# EAGLE design sidedriver_v1 (EAGLE 6.4)
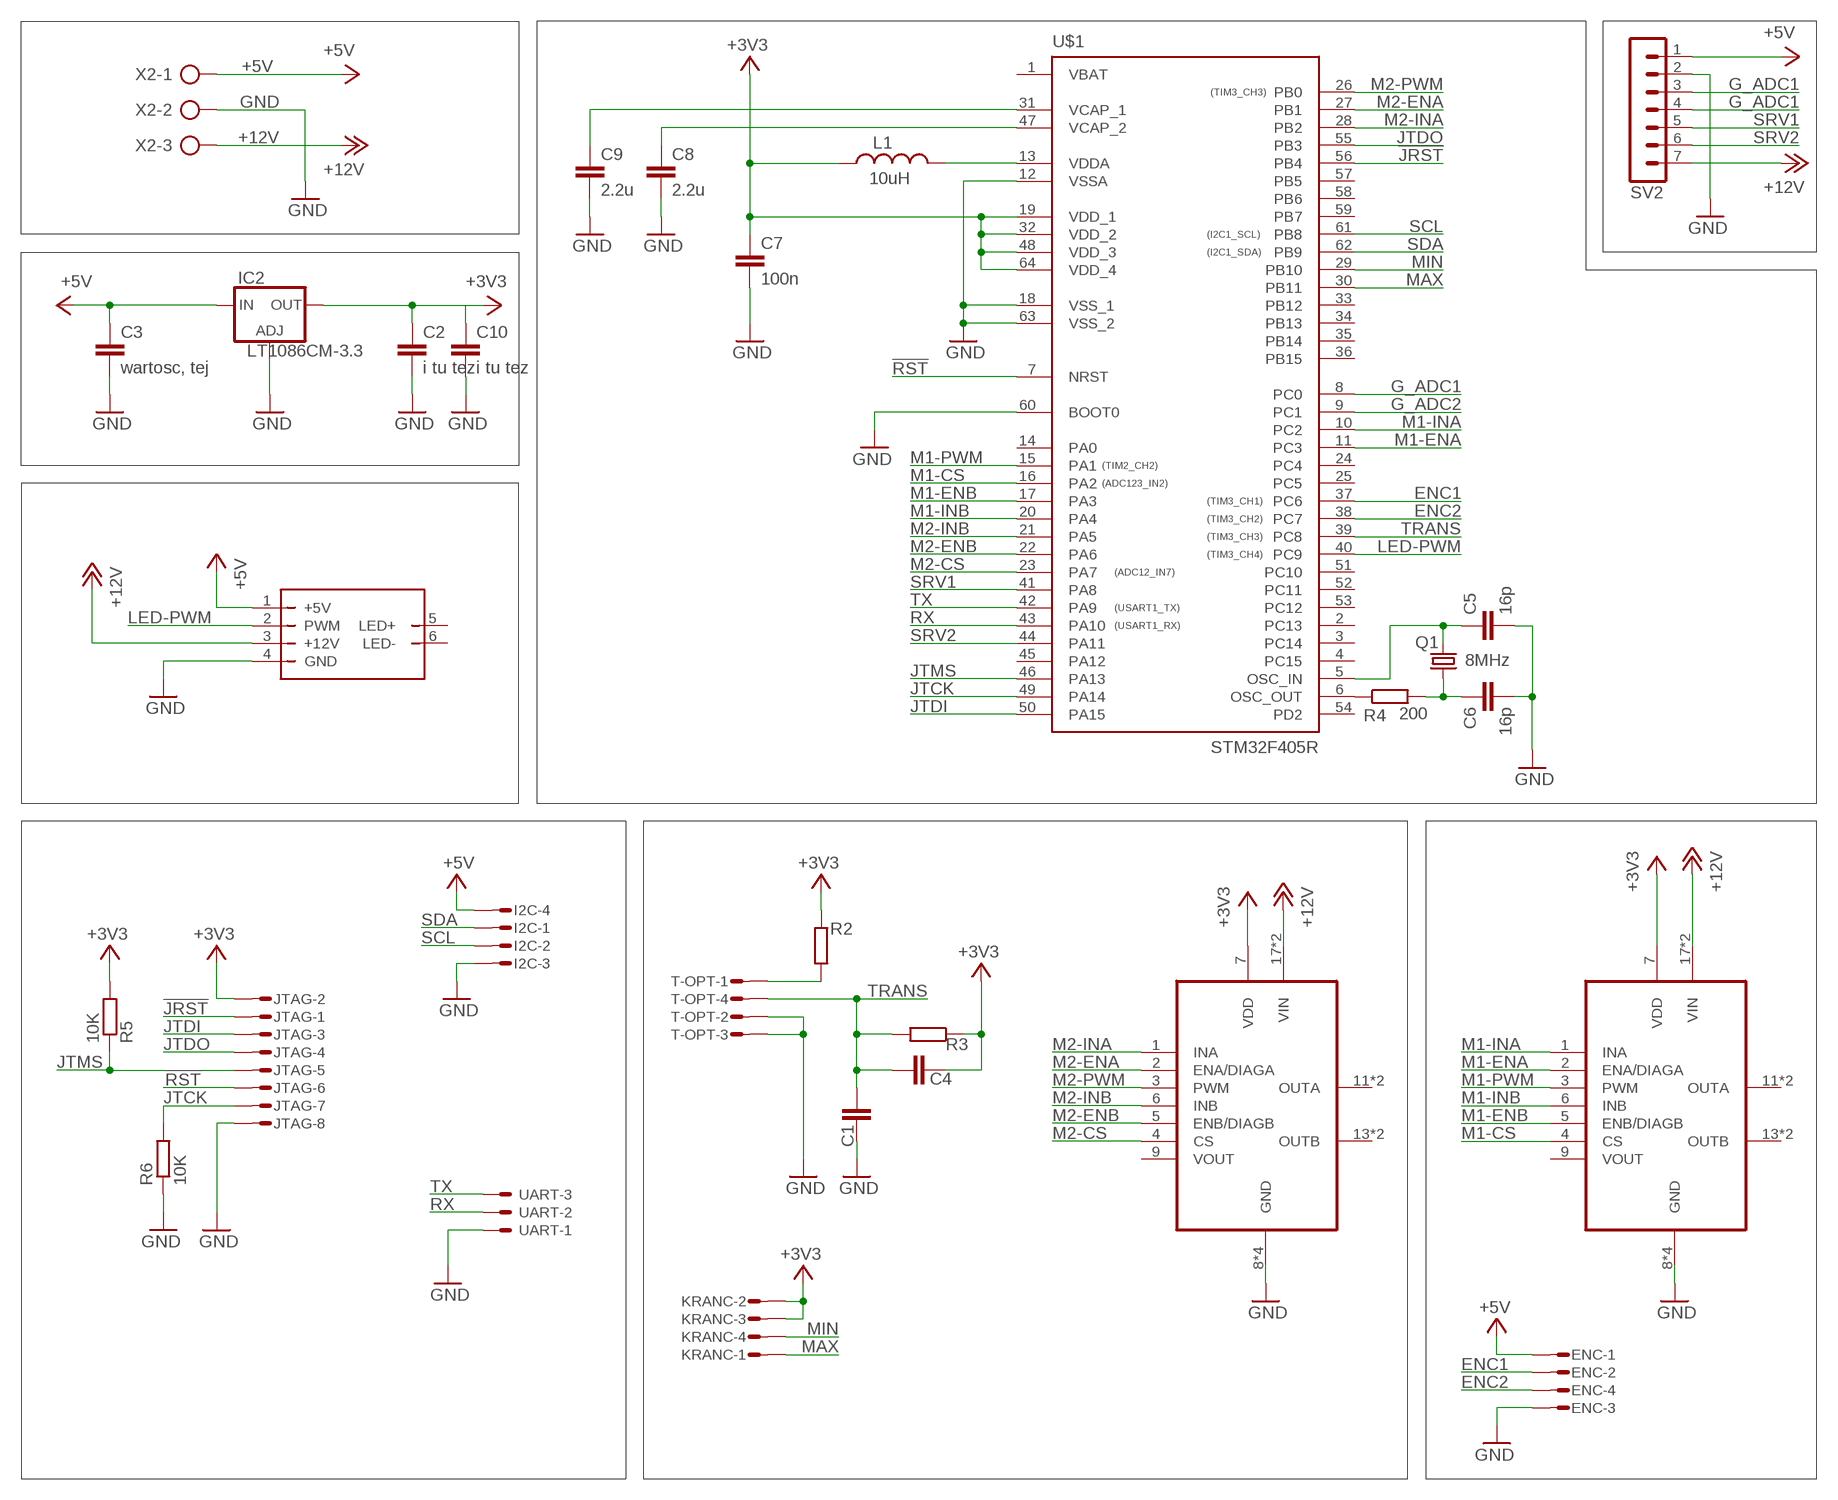
[diagram p0: schematic, sheet 1]

## Parts
C1  C-EUC0603  [C0603]
C2  i tu tez  C-EUC0603  [C0603]
C3  wartosc, tej  C-EUC0603  [C0603]
C4  C-EUC0603  [C0603]
C5  16p  C-EUC0603  [C0603]
C6  16p  C-EUC0603  [C0603]
C7  100n  C-EUC0603  [C0603]
C8  2.2u  C-EUC0603  [C0603]
C9  2.2u  C-EUC0603  [C0603]
C10  i tu tez  C-EUC0603  [C0603]
ENC  MICROMATCH-4  [MICROMATCH-4]
I2C  MICROMATCH-4  [MICROMATCH-4]
IC2  LT1086CM-3.3  LD117AD2MTR  [D2PACK]
JTAG  MICROMATCH-8  [MICROMATCH-8]
KRANC  MICROMATCH-4  [MICROMATCH-4]
L1  10uH  L  [L0805]
Q1  8MHz  CRYSTAL12SMX  [12SMX]
R2  R-EU_R0603  [R0603]
R3  R-EU_R0603  [R0603]
R4  200  R-EU_R0603  [R0603]
R5  10K  R-EU_R0603  [R0603]
R6  10K  R-EU_R0603  [R0603]
SV2  MA07-1  [MA07-1]
T-OPT  MICROMATCH-4  [MICROMATCH-4]
U$1  STM32F405R  [TQFP64]
U$2  LEDD1  [LEDD1]
U$3  POLOLU-1451  [POLOLU-1451]
U$4  POLOLU-1451  [POLOLU-1451]
UART  C-GRID-03-70543  [70543-03]
X2  AK500/3  [AK500/3]

## Nets
!JRST: JTAG.1 U$1.56(PB4)
!RST: JTAG.6 U$1.7(NRST)
+3V3: C2.1 C4.1 C7.1 C10.1 IC2.2(OUT) JTAG.2 KRANC.2 KRANC.3 L1.1 R2.1 R3.1 R5.2 U$1.19(VDD_1) U$1.32(VDD_2) U$1.48(VDD_3) U$1.64(VDD_4) U$3.7(VDD) U$4.7(VDD)
+5V: C3.1 ENC.1 I2C.4 IC2.3(IN) SV2.1 U$2.1(+5V) X2.1
+12V: SV2.7 U$2.3(+12V) U$3.17(VIN) U$3.18(VIN) U$4.17(VIN) U$4.18(VIN) X2.3
ENC1: ENC.2 U$1.37(PC6)
ENC2: ENC.4 U$1.38(PC7)
G_ADC1: SV2.3 U$1.8(PC0)
G_ADC2: SV2.4 U$1.9(PC1)
GND: C1.1 C2.2 C3.2 C5.2 C6.2 C7.2 C8.2 C9.2 C10.2 ENC.3 I2C.3 IC2.1(ADJ) JTAG.8 R6.1 SV2.2 T-OPT.2 T-OPT.3 U$1.12(VSSA) U$1.18(VSS_1) U$1.60(BOOT0) U$1.63(VSS_2) U$2.4(GND) U$3.8(GND) U$3.10(GND) U$3.15(GND) U$3.16(GND) U$4.8(GND) U$4.10(GND) U$4.15(GND) U$4.16(GND) UART.1 X2.2
JTCK: JTAG.7 R6.2 U$1.49(PA14)
JTDI: JTAG.3 U$1.50(PA15)
JTDO: JTAG.4 U$1.55(PB3)
JTMS: JTAG.5 R5.1 U$1.46(PA13)
LED-PWM: U$1.40(PC9) U$2.2(PWM)
M1-CS: U$1.16(PA2) U$4.4(CS)
M1-ENA: U$1.11(PC3) U$4.2(ENA/DIAGA)
M1-ENB: U$1.17(PA3) U$4.5(ENB/DIAGB)
M1-INA: U$1.10(PC2) U$4.1(INA)
M1-INB: U$1.20(PA4) U$4.6(INB)
M1-PWM: U$1.15(PA1) U$4.3(PWM)
M2-CS: U$1.23(PA7) U$3.4(CS)
M2-ENA: U$1.27(PB1) U$3.2(ENA/DIAGA)
M2-ENB: U$1.22(PA6) U$3.5(ENB/DIAGB)
M2-INA: U$1.28(PB2) U$3.1(INA)
M2-INB: U$1.21(PA5) U$3.6(INB)
M2-PWM: U$1.26(PB0) U$3.3(PWM)
MAX: KRANC.1 U$1.30(PB11)
MIN: KRANC.4 U$1.29(PB10)
N$1: R2.2 T-OPT.1
N$4: C6.1 Q1.1 R4.2
N$5: C5.1 Q1.3 U$1.5(OSC_IN)
N$20: L1.2 U$1.13(VDDA)
N$22: R4.1 U$1.6(OSC_OUT)
N$23: C8.1 U$1.47(VCAP_2)
N$24: C9.1 U$1.31(VCAP_1)
RX: U$1.43(PA10) UART.2
SCL: I2C.2 U$1.61(PB8)
SDA: I2C.1 U$1.62(PB9)
SRV1: SV2.5 U$1.41(PA8)
SRV2: SV2.6 U$1.44(PA11)
TRANS: C1.2 C4.2 R3.2 T-OPT.4 U$1.39(PC8)
TX: U$1.42(PA9) UART.3
Unconnected: U$1.1(VBAT) U$1.2(PC13) U$1.3(PC14) U$1.4(PC15) U$1.14(PA0) U$1.24(PC4) U$1.25(PC5) U$1.33(PB12) U$1.34(PB13) U$1.35(PB14) U$1.36(PB15) U$1.45(PA12) U$1.51(PC10) U$1.52(PC11) U$1.53(PC12) U$1.54(PD2) U$1.57(PB5) U$1.58(PB6) U$1.59(PB7) U$2.5(LED+) U$2.6(LED-) U$3.9(VOUT) U$3.11(OUTA) U$3.12(OUTA) U$3.13(OUTB) U$3.14(OUTB) U$4.9(VOUT) U$4.11(OUTA) U$4.12(OUTA) U$4.13(OUTB) U$4.14(OUTB)

## Notes on the sheet
- (TIM3_CH3)
- (I2C1_SCL)
- (I2C1_SDA)
- (TIM2_CH2)
- (ADC123_IN2)
- (TIM3_CH1)
- (TIM3_CH2)
- (TIM3_CH3)
- (TIM3_CH4)
- (ADC12_IN7)
- (USART1_TX)
- (USART1_RX)

## Library data of the parts
C1-C10 = rcl:C-EU: CAPACITOR, European symbol
ENC I2C KRANC T-OPT = con-maritex:MICROMATCH-4: MicroMaTch 4 7-215464-4 / 0-215464-4 Drawing Number C-215464 DDEController.pdf
IC2 = v-reg:LD117A?*: Low drop fixed and adjustable positive voltage regulators 1 A Source: http://www.st.com/stonline/products/literature/ds/7194/ld1117axx.pdf
JTAG = con-maritex:MICROMATCH-8: MicroMaTch 8 7-215464-8 / 0-215464-8 Drawing Number C-215464 DDEController.pdf
L1 = con-maritex:L
Q1 = wb:CRYSTAL: CRYSTAL
R2-R6 = rcl:R-EU_: RESISTOR, European symbol
SV2 = con-lstb:MA07-1: PIN HEADER; OC_FARNELL: unknown; OC_NEWARK: unknown
U$1 = stm32f4:STM32F405R: STM32F405 64 pin LQFP reviewed: YES tested: YES
U$2 = ledd1:LEDD1
U$3 U$4 = pololu:POLOLU-1451
UART = con-molex:C-GRID-03: CONNECTOR wire to board 2.54 mm (0.100") pitch header; OC_FARNELL: unknown; OC_NEWARK: unknown
X2 = con-ptr500:AK500/3: CONNECTOR; OC_FARNELL: unknown; OC_NEWARK: unknown

## Board
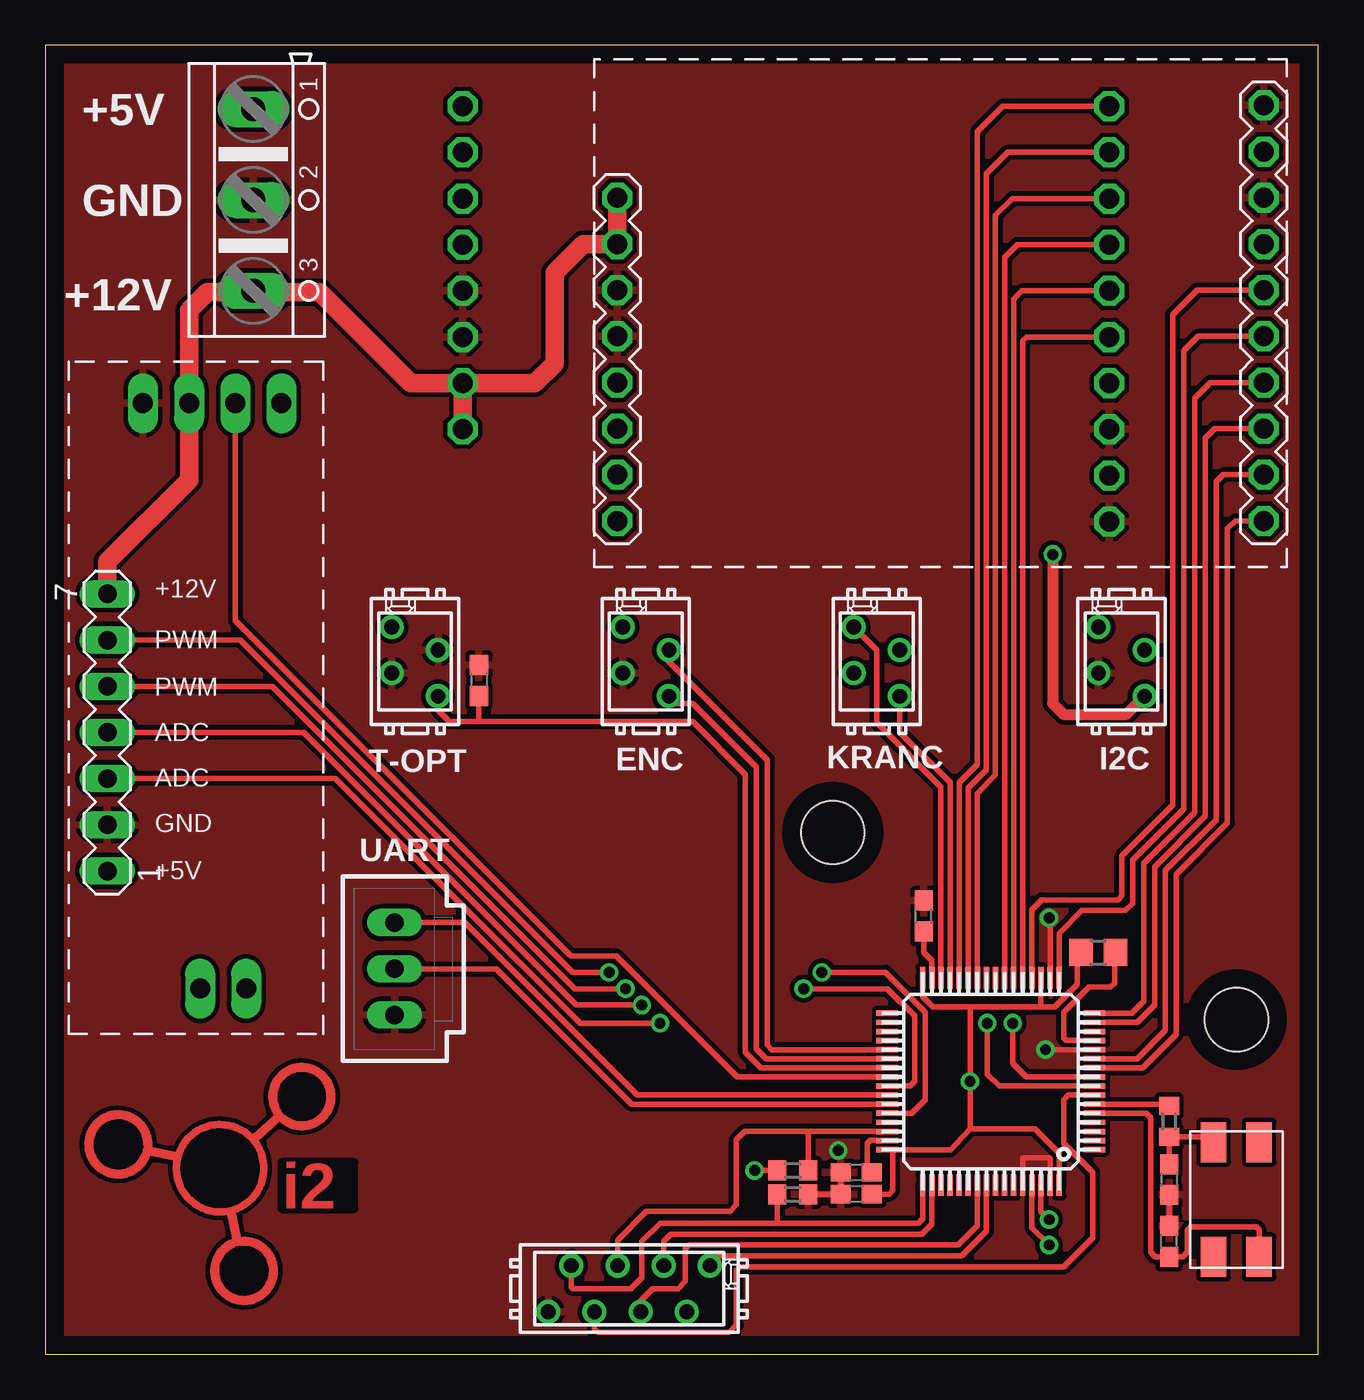
[diagram p1: board, top side]
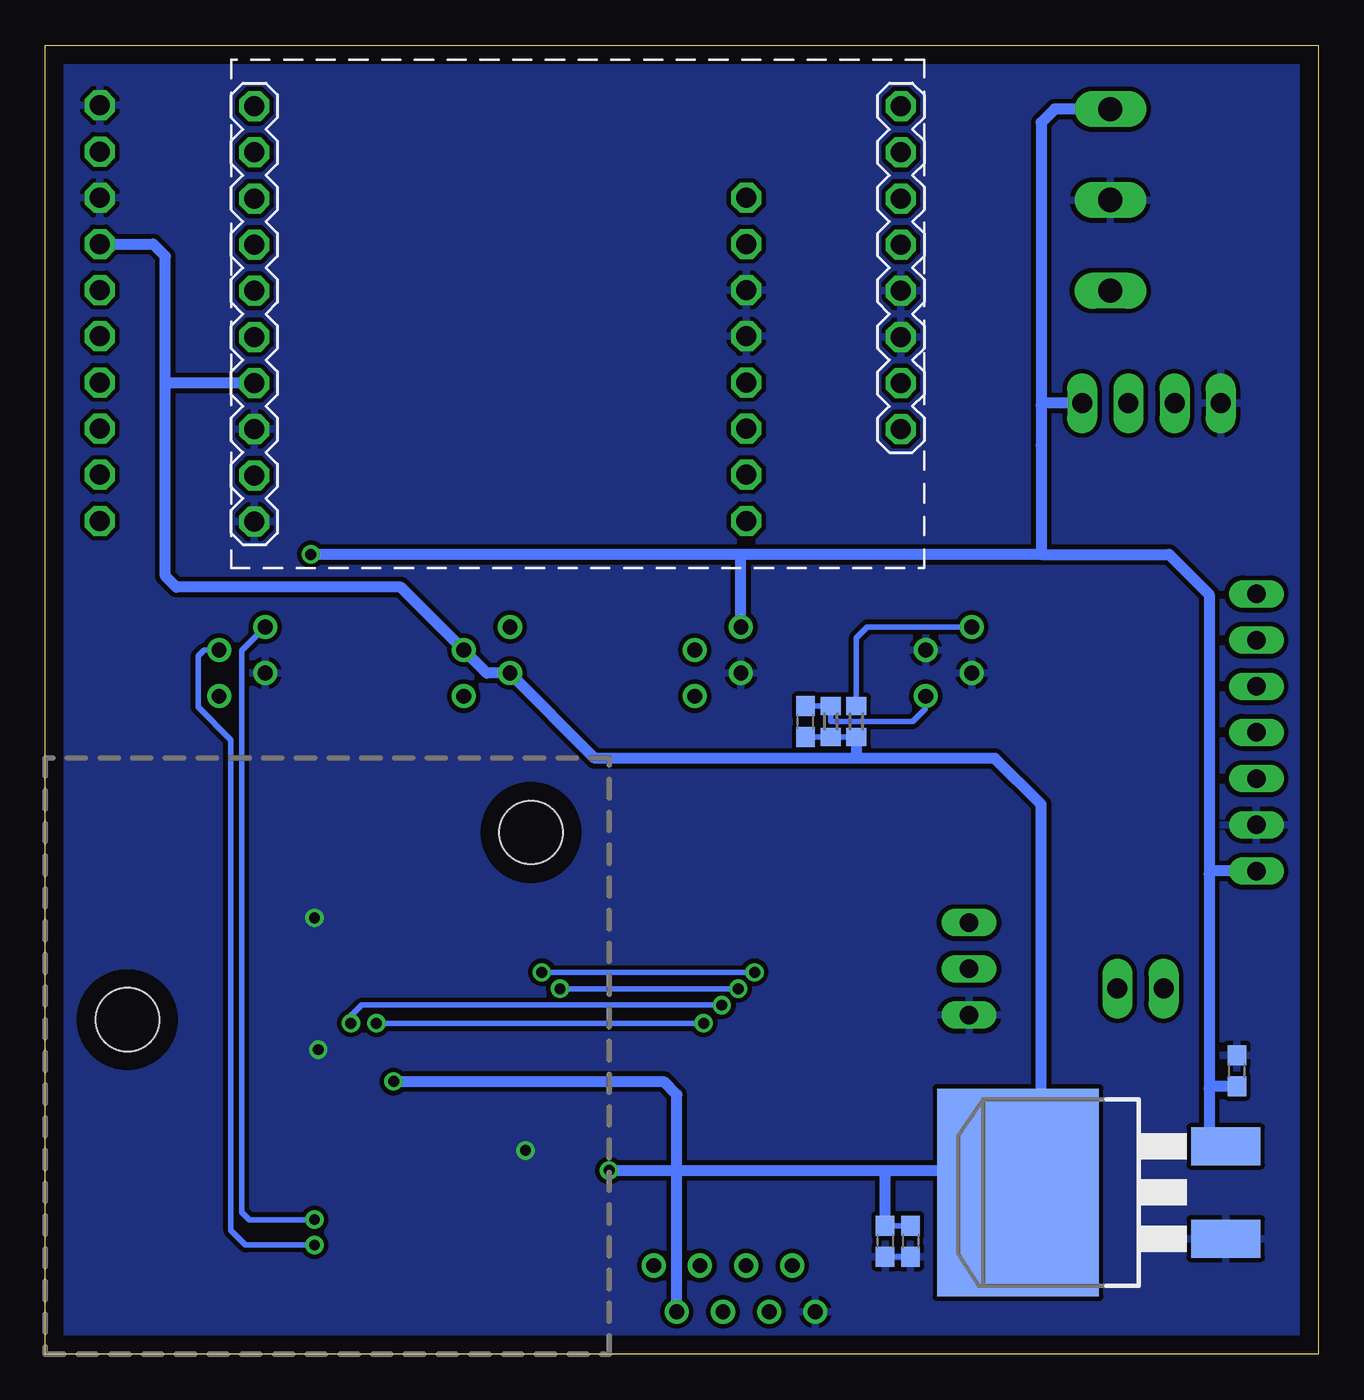
[diagram p2: board, bottom side, seen from below]

Size 70 x 72 mm. Coordinates in mm from the lower left corner, seen from the top.
Outline: 0,0 70,0 70,72 0,72 0,0
Copper layers (1*16): Top 0.035mm / dielectric 1.5mm / Bottom 0.035mm
Design rules "default *": minimum track width 10mil, minimum drill 0.5mm, track to track 6mil, track to pad 6mil, pad to pad 6mil, via to via 6mil, smd to smd 6mil, copper to edge 40mil, drill to drill 8mil, minimum pad ring 10mil, minimum via ring 8mil, stop-mask expansion 4mil, vias tented up to drill 0mil, thermal gap 10mil
Holes 3.5 mm at 65.5,18.4 43.3,28.7

### Footprints (pad centres in the part's own frame; a part is rotated, then mirrored left to right if it is on the bottom)
C0603 = smd 1.1 x 1: 1 -0.85,0; 2 0.85,0
MICROMATCH-4 = drill 0.813: 1 1.905,1.27; 2 0.635,-1.27; 3 -0.635,1.27; 4 -1.905,-1.27
D2PACK = smd 2.083 x 3.81: 1 -2.54,-8.89; 3 2.54,-8.89 | smd 11.43 x 8.89: 2 0,2.54
MICROMATCH-8 = drill 0.813: 1 4.445,1.27; 2 3.175,-1.27; 3 1.905,1.27; 4 0.635,-1.27; 5 -0.635,1.27; 6 -1.905,-1.27; 7 -3.175,1.27; 8 -4.445,-1.27
L0805 = smd 1.3 x 1.5: 1 -0.95,0; 2 0.95,0
12SMX = smd 2.2 x 1.4: 1 -3.15,-1.25; 2 -3.15,1.25; 3 3.15,1.25; 4 3.15,-1.25
R0603 = smd 1 x 1.1: 1 -0.85,0; 2 0.85,0
MA07-1 = drill 1.016 long: 1 -7.62,0; 2 -5.08,0; 3 -2.54,0; 4 0,0; 5 2.54,0; 6 5.08,0; 7 7.62,0
TQFP64 = smd 1.2 x 0.3: 1 -5.7,3.75; 2 -5.7,3.25; 3 -5.7,2.75; 4 -5.7,2.25; 5 -5.7,1.75; 6 -5.7,1.25; 7 -5.7,0.75; 8 -5.7,0.25; 9 -5.7,-0.25; 10 -5.7,-0.75; 11 -5.7,-1.25; 12 -5.7,-1.75; 13 -5.7,-2.25; 14 -5.7,-2.75; 15 -5.7,-3.25; 16 -5.7,-3.75; 33 5.7,-3.75; 34 5.7,-3.25; 35 5.7,-2.75; 36 5.7,-2.25; 37 5.7,-1.75; 38 5.7,-1.25; 39 5.7,-0.75; 40 5.7,-0.25; 41 5.7,0.25; 42 5.7,0.75; 43 5.7,1.25; 44 5.7,1.75; 45 5.7,2.25; 46 5.7,2.75; 47 5.7,3.25; 48 5.7,3.75 | smd 0.3 x 1.2: 17 -3.75,-5.7; 18 -3.25,-5.7; 19 -2.75,-5.7; 20 -2.25,-5.7; 21 -1.75,-5.7; 22 -1.25,-5.7; 23 -0.75,-5.7; 24 -0.25,-5.7; 25 0.25,-5.7; 26 0.75,-5.7; 27 1.25,-5.7; 28 1.75,-5.7; 29 2.25,-5.7; 30 2.75,-5.7; 31 3.25,-5.7; 32 3.75,-5.7; 49 3.75,5.7; 50 3.25,5.7; 51 2.75,5.7; 52 2.25,5.7; 53 1.75,5.7; 54 1.25,5.7; 55 0.75,5.7; 56 0.25,5.7; 57 -0.25,5.7; 58 -0.75,5.7; 59 -1.25,5.7; 60 -1.75,5.7; 61 -2.25,5.7; 62 -2.75,5.7; 63 -3.25,5.7; 64 -3.75,5.7
LEDD1 = drill 1.1 long: 1 2.3,11.71; 2 2.3,9.17; 3 2.3,6.63; 4 2.3,4.09; 5 34.5,9.77; 6 34.5,7.23
POLOLU-1451 = drill 1.1 octagon: 1 -16.51,10.16; 2 -16.51,7.62; 3 -16.51,5.08; 4 -16.51,2.54; 5 -16.51,0; 6 -16.51,-2.54; 7 -16.51,-5.08; 8 -16.51,-7.62; 9 -16.51,-10.16; 10 -16.51,-12.7; 11 19.05,10.16; 12 19.05,7.62; 13 19.05,5.08; 14 19.05,2.54; 15 19.05,0; 16 19.05,-2.54; 17 19.05,-5.08; 18 19.05,-7.62
70543-03 = drill 1.016 long: 1 -2.54,0; 2 0,0; 3 2.54,0
AK500/3 = drill 1.321 long: 1 -5.004,0; 2 0,0; 3 5.004,0

### Placement (x,y rotation side)
C1  23.84,37.07 270 top
C2  22.43,6.21 270 bottom
C3  4.47,15.59 90 bottom
C4  28.2,34.8 90 bottom
C5  61.8,6.2 90 top
C6  61.8,9.6 270 top
C7  44.6,8.8 180 top
C8  44.6,10 180 top
C9  48.3,24.1 90 top
C10  23.82,6.21 270 bottom
ENC  33.02,38.1 90 top
I2C  59.18,38.1 90 top
IC2  13.97,8.89 90 bottom
JTAG  32.1,3.6 0 top
KRANC  45.72,38.1 90 top
L1  57.9,22.1 0 top
Q1  65.5,8.5 270 top
R2  25.4,34.8 90 bottom
R3  26.8,34.8 90 bottom
R4  61.8,12.8 270 top
R5  41.1,10.1 180 top
R6  41.1,8.8 180 top
SV2  3.4,34.2 90 top
T-OPT  20.32,38.1 90 top
U$1  52,15 180 top
U$2  1.27,54.61 270 top
U$3  42,58.5 0 bottom
U$4  50.5,56 180 top
U$5  [I2-LOGO]  9.8,10.6 0 top
UART  19.2,21.2 90 top
X2  11.43,63.5 270 top

### Tracks (layer width: path | path; a pad name or v marks a point on that pad's centre or on a via)
!JRST
  Top 0.305: U$1.56 51.75,6.75 50.4,5.4 37,5.4 36.55,4.95 JTAG.1
!RST
  Top 0.305: JTAG.6 30.2,1.41 30.4,1.2 37.6,1.2 38,1.6 38,4.6 38.2,4.8 56,4.8 57.6,6.4 57.6,10 56,11.6 56,14 56.25,14.25 U$1.7
+3V3  (via drill 0.6)
  Top 0.305: U$1.48 46.6,11.25 | C7.1 46.4,8.8 46.6,9 46.6,11.25 | v39,10.1 R5.2 | 50.85,12.4 v50.85,15 50.85,19.05 50.8,19.1 | 50.85,12.4 50.05,11.5 49.8,11.25 46.6,11.25 | U$1.19 54.75,19.15 54.8,19.1 | U$1.64 55.75,11.05 54.4,12.4 50.85,12.4 | L1.1 56.75,21.5 56.75,20.35 55.5,19.1 54.8,19.1 | U$1.32 48.25,19.65 48.8,19.1 50.8,19.1 | 50.8,19.1 54.8,19.1
  Bottom 0.305: C10.1 C2.1 | R2.1 R3.1 C4.1 | 23.82,10.08 23.8,10.1 | 17.72,10.1 IC2.2
  Bottom 0.61: IC2.2 15.24,10.16 15.24,30.24 17.78,32.78 25.4,32.78 | 44.47,37.47 45.72,37.47 KRANC.2 50.45,42.2 62.8,42.2 63.4,42.8 63.4,53.4 | C10.1 23.82,10.08 | JTAG.2 35.27,10.1 | U$3.7 63.18,53.42 63.4,53.4 | U$4.7 64.08,61.08 63.4,60.4 63.4,53.4 | 25.4,32.78 39.78,32.78 44.47,37.47 | R2.1 25.4,32.78 | 35.27,10.1 35.27,14.28 36,15 v50.85,15 | v39,10.1 35.27,10.1 | KRANC.3 44.47,37.47 | 35.27,10.1 23.8,10.1 17.72,10.1
+5V  (via drill 0.6)
  Top 0.61: v55.4,44 55.4,35.8 56,35.2 59.46,35.2 I2C.4
  Bottom 0.305: 31.75,43.95 31.8,44
  Bottom 0.61: X2.1 14.5,68.5 15.24,67.76 15.24,52.2 | 15.24,52.2 15.24,49.99 15.23,44 | 15.23,44 31.8,44 v55.4,44 | ENC.1 31.75,43.95 | U$2.1 15.13,52.31 15.24,52.2 | 15.23,44 8.2,44 6,41.8 6,26.4 | 6,26.4 6,14.6 | 6,14.6 6,11.8 5.8,11.6 5.25,11.6 IC2.3 | SV2.1 5.82,26.58 6,26.4 | C3.1 5.86,14.74 6,14.6
+12V
  Top 0.813: 11.35,58.42 X2.3 11.51,58.42
  Top 1.016: U$4.18 U$4.17 29.58,61.08 28,59.5 28,54.5 26.92,53.42 U$3.17 | 11.35,58.42 8.89,58.42 7.9,57.43 U$2.3 7.9,48.1 3.4,43.6 SV2.7 | U$3.18 U$3.17 | 11.51,58.42 15.08,58.42 20.08,53.42 U$3.17
ENC1
  Top 0.305: U$1.37 39.95,16.75 39.7,17 39.7,32.7 34.29,38.11 ENC.2
ENC2
  Top 0.305: U$1.38 39.65,16.25 39.1,16.8 39.1,32.3 35.6,35.8 34.69,35.8 ENC.4
G_ADC1  (via drill 0.6)
  Top 0.305: U$1.8 52.45,14.75 51.8,15.4 v51.8,18.2 | v33.8,18.2 29.4,18.2 15.94,31.66 SV2.3
  Bottom 0.305: v51.8,18.2 v33.8,18.2
G_ADC2  (via drill 0.6)
  Top 0.305: U$1.9 53.95,15.25 53.2,16 v53.2,18.2 | v32.8,19.2 29.2,19.2 14.2,34.2 SV2.4
  Bottom 0.305: v53.2,18.2 53.2,18.6 52.6,19.2 v32.8,19.2
GND  (via drill 0.6)
  Top 0.305: C6.2 C5.2 | C8.2 C7.2 R6.1 | U$1.63 55.25,10.75 55.2,10.8 53.8,10.8 53.75,10.75 U$1.60 | U$1.12 v55,16.75 | U$1.18 55.25,23.95 v55.2,24
  Bottom 0.305: C2.2 C10.2
  other vias: 43.6,11.2
  pour Top (isolate 0.254): 0,0 70,0 70,72 0,72
  pour Bottom (isolate 0.254): 0,0 70,0 70,72 0,72
JTCK
  Top 0.305: U$1.49 48.25,7.45 48,7.2 40.4,7.2 | 40.4,7.2 33.8,7.2 32.8,6.2 32.8,4.2 32.2,3.6 29,3.6 28.93,3.67 JTAG.7 | R6.2 40.25,7.25 40.4,7.2
JTDI
  Top 0.305: U$1.50 48.75,7.15 48.2,6.6 34.4,6.6 34.01,6.21 JTAG.3
JTDO
  Top 0.305: U$1.55 51.25,7.05 50.2,6 35.4,6 35.2,5.8 35.2,4 34.8,3.6 33.4,3.6 32.73,2.94 JTAG.4
JTMS
  Top 0.305: JTAG.5 31.46,6.26 33.05,7.85 37.65,7.85 38,8.2 38,11.8 38.45,12.25 42,12.25 | U$1.46 42,12.25 | R5.1 41.95,12.2 42,12.25
LED-PWM
  Top 0.305: U$1.40 38.05,15.25 31.4,21.9 28.9,21.9 10.44,40.36 U$2.2
M1-CS
  Top 0.305: U$1.16 59.75,18.75 60.4,19.4 60.4,27 63.2,29.8 63.2,52.6 64.06,53.46 U$4.4
M1-ENA
  Top 0.305: U$1.11 60.05,16.25 61.6,17.8 61.6,26.6 64.4,29.4 64.4,48 64.78,48.38 U$4.2
M1-ENB
  Top 0.305: U$4.5 63.4,56 62.6,55.2 62.6,30 59.8,27.2 59.8,24.8 59.4,24.4 57,24.4 55.75,23.15 U$1.17
M1-INA
  Top 0.305: U$1.10 60.35,15.75 62.2,17.6 62.2,26.4 65.01,29.21 65.01,45.41 65.44,45.84 U$4.1
M1-INB
  Top 0.305: U$4.6 63.34,58.54 62,57.2 62,30.2 59.2,27.4 59.2,25.2 59,25 54.8,25 54.25,24.45 U$1.20
M1-PWM
  Top 0.305: U$1.15 60.05,18.25 61,19.2 61,26.8 63.8,29.6 63.8,50.4 64.32,50.92 U$4.3
M2-CS
  Top 0.305: U$1.23 52.75,60.35 53.44,61.04 U$3.4
M2-ENA
  Top 0.305: U$1.27 50.75,31.15 51.75,32.15 51.75,64.95 52.92,66.12 U$3.2
M2-ENB
  Top 0.305: U$1.22 53.25,58.05 53.7,58.5 U$3.5
M2-INA
  Top 0.305: U$1.28 50.25,31.45 51.25,32.45 51.25,67.25 52.66,68.66 U$3.1
M2-INB
  Top 0.305: U$1.21 53.75,55.75 53.96,55.96 U$3.6
M2-PWM
  Top 0.305: U$1.26 51.25,30.85 52.25,31.85 52.25,62.65 53.18,63.58 U$3.3
MAX
  Top 0.305: KRANC.1 45.72,38.73 45.72,34.74 49.25,31.21 U$1.30
MIN
  Top 0.305: KRANC.4 46.99,34.21 49.75,31.45 U$1.29
N$1
  Bottom 0.305: R2.2 25.4,39.4 24.8,40.01 T-OPT.1
N$4
  Top 0.305: C6.1 R4.2 63.95,11.95 Q1.1
N$5
  Top 0.305: U$1.5 60.55,13.25 60.8,13 60.8,5.6 61.05,5.35 C5.1 62.55,5.35 62.8,5.6 62.8,6.8 63,7 66.6,7 66.75,6.85 Q1.3
N$20
  Top 0.305: U$1.13 56.15,17.25 56,17.4 56,18.8 57.4,20.2 58.6,20.2 58.8,20.4 58.8,21.65 L1.2
N$22
  Top 0.305: U$1.6 61.7,13.75 R4.1
N$23
  Top 0.305: U$1.47 45.35,11.75 45.2,11.6 45.2,9.85 C8.1
N$24
  Top 0.305: U$1.31 48.75,21.65 48.3,22.1 C9.1
RX
  Top 0.305: U$1.43 32.25,13.75 24.8,21.2 UART.2
SCL  (via drill 0.6)
  Top 0.305: U$1.61 54.25,6.95 v55.2,6
  Bottom 0.305: v55.2,6 59,6 59.8,6.8 59.8,33.8 61.6,35.6 61.6,38.4 61.27,38.73 I2C.2
SDA  (via drill 0.6)
  Top 0.305: U$1.62 54.75,7.85 v55.2,7.4
  Bottom 0.305: I2C.1 59.2,38.72 59.2,7.8 58.8,7.4 v55.2,7.4
SRV1  (via drill 0.6)
  Top 0.305: U$1.41 47.55,14.75 47.8,15 47.8,18.6 46.3,20.1 v41.7,20.1 | v31.9,20.1 29.1,20.1 12.46,36.74 SV2.5
  Bottom 0.305: v41.7,20.1 v31.9,20.1
SRV2  (via drill 0.6)
  Top 0.305: U$1.44 47.65,13.25 48.4,14 48.4,18.8 46.2,21 v42.7,21 | v31,21 29,21 10.72,39.28 SV2.6
  Bottom 0.305: v42.7,21 v31,21
TRANS
  Top 0.305: U$1.39 39.35,15.75 38.5,16.6 38.5,31.9 35.6,34.8 23.8,34.8 | T-OPT.4 21.59,35.41 22.2,34.8 23.8,34.8 | C1.2 23.84,34.84 23.8,34.8
  Bottom 0.305: C4.2 R3.2 26.8,34.8 22.3,34.8 21.6,35.5 21.6,36.19 T-OPT.4
TX
  Top 0.305: U$1.42 32.55,14.25 23.06,23.74 UART.3

### Text on the board
tNames: +5V | GND | +12V | +12V | PWM | PWM | ADC | ADC | GND | +5V